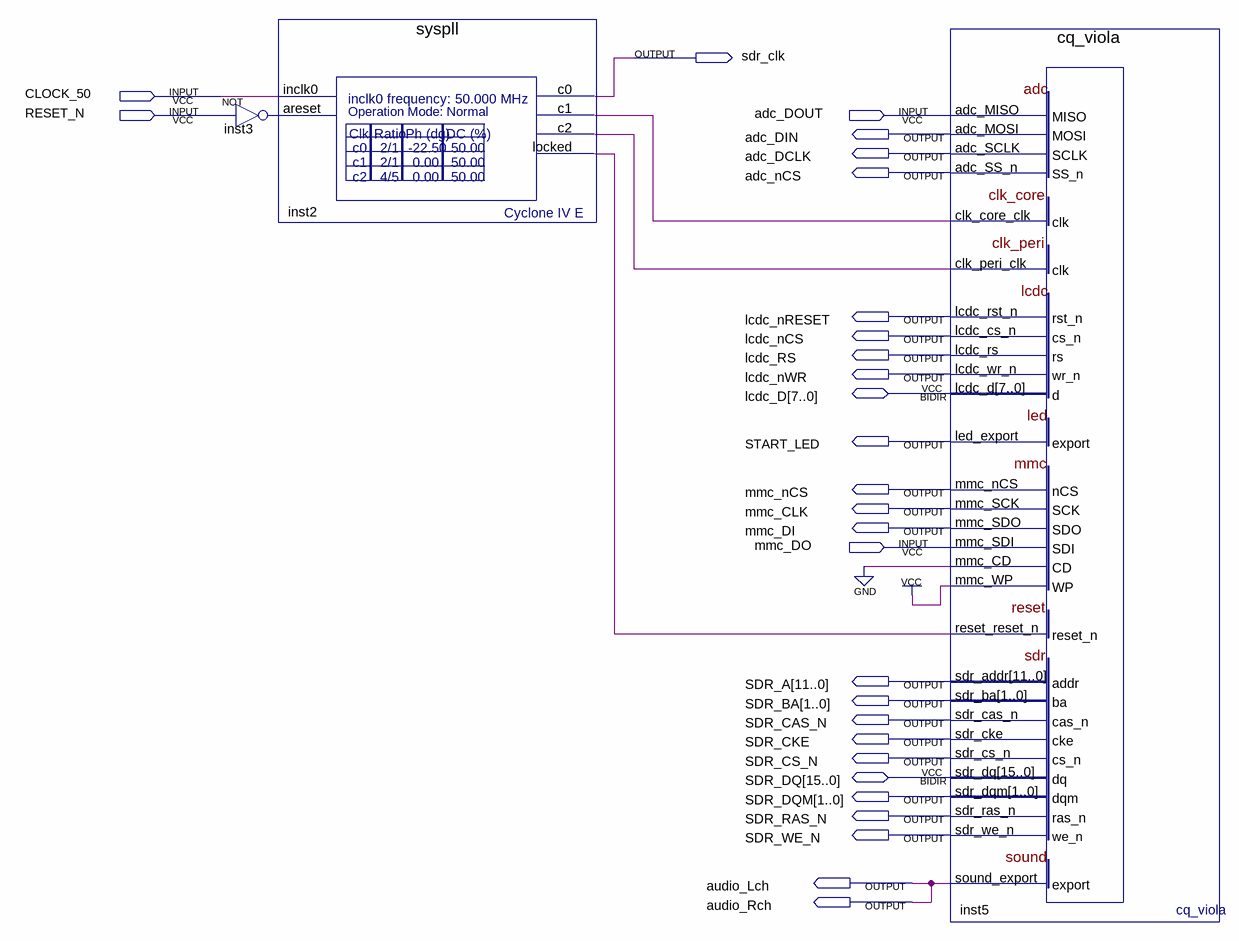
[diagram p0: schematic sheet]
// Quartus schematic cq_viola_top.bdf as structural Verilog: 3 symbols, 28 pins
module cq_viola_top (
  input  CLOCK_50,
  input  RESET_N,
  input  adc_DOUT,
  input  mmc_DO,
  inout  [7:0] lcdc_D,
  inout  [15:0] SDR_DQ,
  output sdr_clk,
  output adc_DIN,
  output adc_DCLK,
  output adc_nCS,
  output lcdc_nRESET,
  output lcdc_nCS,
  output lcdc_RS,
  output lcdc_nWR,
  output START_LED,
  output mmc_nCS,
  output mmc_CLK,
  output mmc_DI,
  output [11:0] SDR_A,
  output [1:0] SDR_BA,
  output SDR_CAS_N,
  output SDR_CKE,
  output SDR_CS_N,
  output [1:0] SDR_DQM,
  output SDR_RAS_N,
  output SDR_WE_N,
  output audio_Lch,
  output audio_Rch
);

  wire inst2_c1, inst2_c2, inst2_locked, inst3_out;

  syspll inst2 (
    .inclk0(CLOCK_50), .areset(inst3_out), .c0(sdr_clk), .c1(inst2_c1), .c2(inst2_c2), .locked(inst2_locked));
  not inst3 (inst3_out, RESET_N);
  cq_viola inst5 (
    .adc_MISO(adc_DOUT), .clk_core_clk(inst2_c1), .clk_peri_clk(inst2_c2), .mmc_SDI(mmc_DO), .mmc_CD(1'b0),
    .mmc_WP(1'b1), .reset_reset_n(inst2_locked), .adc_MOSI(adc_DIN), .adc_SCLK(adc_DCLK), .adc_SS_n(adc_nCS),
    .lcdc_rst_n(lcdc_nRESET), .lcdc_cs_n(lcdc_nCS), .lcdc_rs(lcdc_RS), .lcdc_wr_n(lcdc_nWR),
    .led_export(START_LED), .mmc_nCS(mmc_nCS), .mmc_SCK(mmc_CLK), .mmc_SDO(mmc_DI), .sdr_addr(SDR_A),
    .sdr_ba(SDR_BA), .sdr_cas_n(SDR_CAS_N), .sdr_cke(SDR_CKE), .sdr_cs_n(SDR_CS_N), .sdr_dqm(SDR_DQM),
    .sdr_ras_n(SDR_RAS_N), .sdr_we_n(SDR_WE_N), .sound_export(audio_Lch), .lcdc_d(lcdc_D), .sdr_dq(SDR_DQ));

  assign audio_Rch = audio_Lch;
endmodule
